# Altium project meteo.PrjPCB
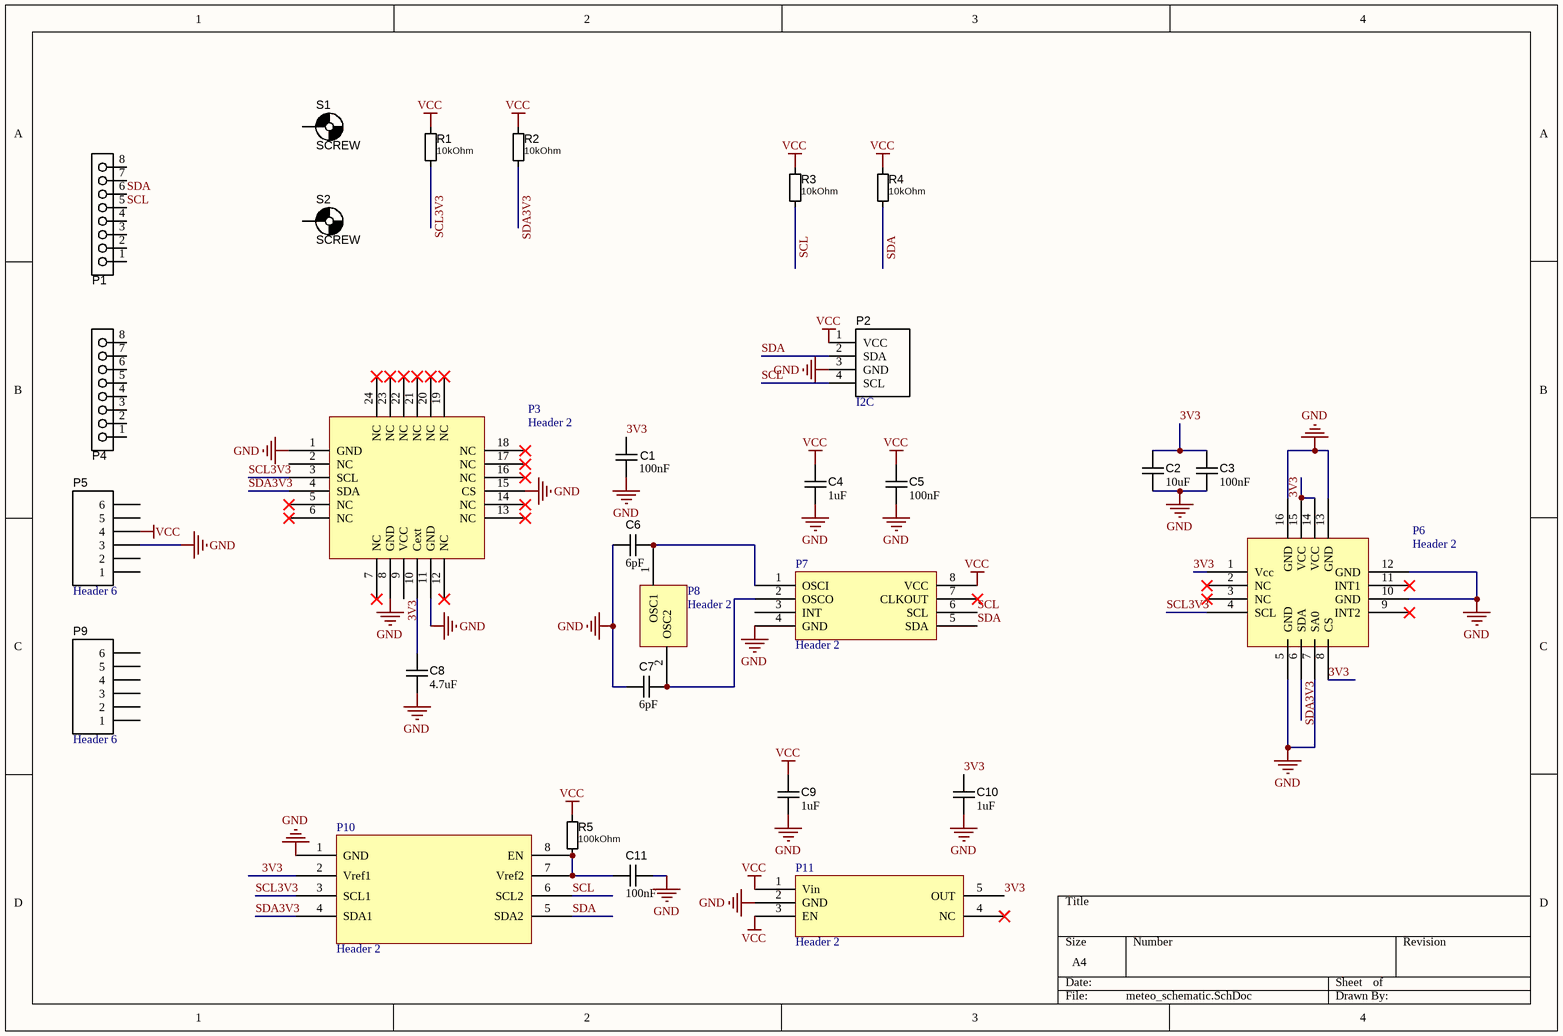
[diagram p0: meteo_schematic.SchDoc]
1 sheet, 29 parts. Net scope: global (net labels, ports and power ports of the same name join across sheets).
Board file: PCB_meteo.PcbDoc

## Sheet meteo_schematic.SchDoc
size A4

### Parts
C1  value 100nF  [C/0805]  (hidden comment: C/0805/100nF)
C2  value 10uF  [C/0805]  (hidden comment: C)
C3  value 100nF  [C/0805]  (hidden comment: C)
C4  value 1uF  [C/0805]  (hidden comment: C/0805/100nF)
C5  value 100nF  [C/0805]  (hidden comment: C/0805/100nF)
C6  value 6pF  [C/0805]  (hidden comment: C)
C7  value 6pF  [C/0805]  (hidden comment: C)
C8  value 4.7uF  [C/0805]  (hidden comment: C/0805/100nF)
C9  value 1uF  [C/0805]  (hidden comment: C/0805/100nF)
C10  value 1uF  [C/0805]  (hidden comment: C/0805/100nF)
C11  value 100nF  [C/0805]  (hidden comment: C/0805/100nF)
P1  Header 8  [Arduino Pad 8]  (value not drawn)
P2  I2C  [TYCO/215079-4]
P3  Header 2  [Si7005]
P4  Header 8  [Arduino Pad 8]  (value not drawn)
P5  Header 6  [Arduino Pad 6]
P6  Header 2  [HCLGA-16L]
P7  Header 2  [PCA8565TS]
P8  Header 2  [Quartz]
P9  Header 6  [Arduino Pad 6]
P10  Header 2  [PCA9306DP1]
P11  Header 2  [TLV70033DDCR]
R1  10kOhm  [R/0805]
R2  10kOhm  [R/0805]
R3  10kOhm  [R/0805]
R4  10kOhm  [R/0805]
R5  100kOhm  [R/0805]
S1  SCREW  [HW/SCREW/M2_5]
S2  SCREW  [HW/SCREW/M2_5]

### Nets
GND: C1.1 C2.1 C3.1 C4.1 C5.1 C6.2 C7.2 C8.1 C9.1 C10.1 C11.1 P2.3(GND) P3.1(GND) P3.8(GND) P3.11(GND) P3.15(CS) P5.3 P6.5(GND) P6.7(SA0) P6.10(GND) P6.12(GND) P6.13(GND) P6.16(GND) P7.4(GND) P10.1(GND) P11.2(GND)
VCC: C4.2 C5.2 C9.2 P2.1(VCC) P5.4 P7.8(VCC) P11.1(Vin) P11.3(EN) R1.2 R2.2 R3.2 R4.2 R5.2
3V3: C1.2 C2.2 C3.2 C10.2 P3.9(VCC) P6.1(Vcc) P6.8(CS) P6.14(VCC) P6.15(VCC) P10.2(Vref1) P11.5(OUT)
SCL: P1.5 P2.4(SCL) P7.6(SCL) P10.6(SCL2) R3.1
SCL3V3: P3.3(SCL) P6.4(SCL) P10.3(SCL1) R1.1
SDA: P1.6 P2.2(SDA) P7.5(SDA) P10.5(SDA2) R4.1
SDA3V3: P3.4(SDA) P6.6(SDA) P10.4(SDA1) R2.1
NetC6_1: C6.1 P7.1(OSCI) P8.1(OSC1)
NetC7_1: C7.1 P7.2(OSCO) P8.2(OSC2)
NetC8_2: C8.2 P3.10(Cext)
NetC11_2: C11.2 P10.7(Vref2) P10.8(EN) R5.1

Not connected (* = marked no-connect by the designer): P1 1 2 3 4 7 8; P3 2(NC) 5(NC)* 6(NC)* 7(NC)* 12(NC)* 13(NC)* 14(NC)* 16(NC)* 17(NC)* 18(NC)* 19(NC)* 20(NC)* 21(NC)* 22(NC)* 23(NC)* 24(NC)*; P4 1 2 3 4 5 6 7 8; P5 1 2 5 6; P6 2(NC)* 3(NC)* 9(INT2)* 11(INT1)*; P7 3(INT) 7(CLKOUT)*; P9 1 2 3 4 5 6; P11 4(NC)*; S1 1; S2 1

### Library data of the parts
C1 C4 C5 C8-C11 = C/0805/100nF: Capacitor; Published: 8-Jun-2000; LatestRevisionDate: 17-Jul-2002; LatestRevisionNote: Re-released for DXP Platform.; PackageReference: RAD-0.3; Publisher: Altium Limited
C2 C3 C6 C7 = C: Capacitor; Published: 8-Jun-2000; LatestRevisionDate: 17-Jul-2002; LatestRevisionNote: Re-released for DXP Platform.; PackageReference: RAD-0.3; Publisher: Altium Limited
P1 P4 = Header 8: Header, 8-Pin; LatestRevisionDate: 17-Jul-2002; LatestRevisionNote: Re-released for DXP Platform.; Publisher: Altium Limited
P2 = Micromatch-I2C: Micromatch I2C Connector
P3 = Si7005: Header, 2-Pin; LatestRevisionDate: 17-Jul-2002; LatestRevisionNote: Re-released for DXP Platform.; Publisher: Altium Limited
P5 P9 = Header 6: Header, 6-Pin; LatestRevisionDate: 17-Jul-2002; LatestRevisionNote: Re-released for DXP Platform.; Publisher: Altium Limited
P6 = Barometer LPS331AP: Header, 2-Pin; LatestRevisionDate: 17-Jul-2002; LatestRevisionNote: Re-released for DXP Platform.; Publisher: Altium Limited
P7 = PCA8565: Header, 2-Pin; LatestRevisionDate: 17-Jul-2002; LatestRevisionNote: Re-released for DXP Platform.; Publisher: Altium Limited
P8 = Xtal32768khz: Header, 2-Pin; LatestRevisionDate: 17-Jul-2002; LatestRevisionNote: Re-released for DXP Platform.; Publisher: Altium Limited
P10 = PCA9306DP1: Header, 2-Pin; LatestRevisionDate: 17-Jul-2002; LatestRevisionNote: Re-released for DXP Platform.; Publisher: Altium Limited
P11 = TLV700xx: Header, 2-Pin; LatestRevisionDate: 17-Jul-2002; LatestRevisionNote: Re-released for DXP Platform.; Publisher: Altium Limited
R1-R5 = R: Resistor; Published: 8-Jun-2000; LatestRevisionDate: 17-Jul-2002; LatestRevisionNote: Re-released for DXP Platform.; PackageReference: AXIAL-0.4; Publisher: Altium Limited
  R1-R4: Value: 10kOhm
  R5: Value: 100kOhm